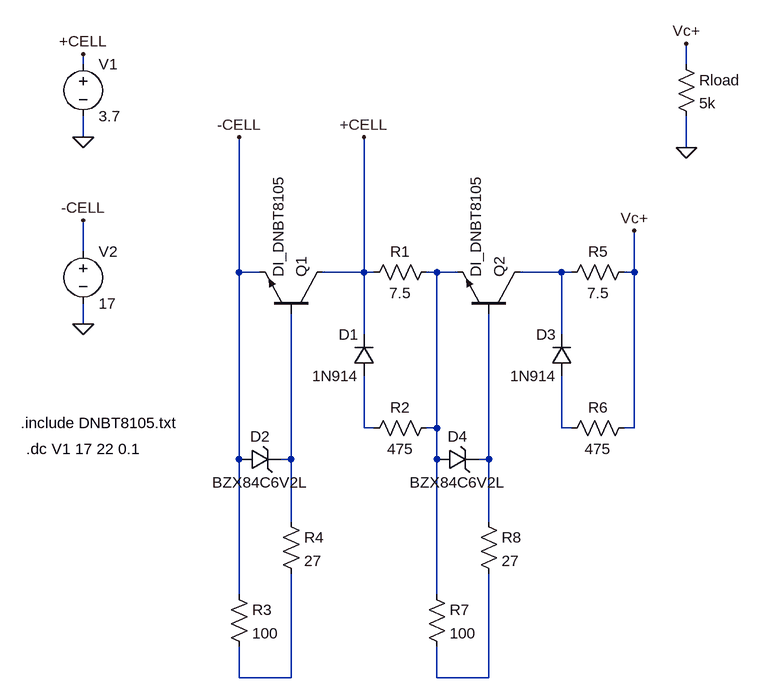
[diagram p0: schematic BalanceLeakage.asc]
BalanceLeakage.asc, the LTspice schematic file:
Version 4
SHEET 1 1096 680
WIRE 32 -272 32 -288
WIRE 960 -272 960 -304
WIRE 32 -160 32 -192
WIRE 960 -144 960 -192
WIRE 32 16 32 -32
WIRE 272 48 272 -160
WIRE 304 48 272 48
WIRE 464 48 464 -160
WIRE 464 48 400 48
WIRE 480 48 464 48
WIRE 576 48 560 48
WIRE 608 48 576 48
WIRE 768 48 704 48
WIRE 784 48 768 48
WIRE 880 48 880 -16
WIRE 880 48 864 48
WIRE 32 128 32 96
WIRE 464 144 464 48
WIRE 768 144 768 48
WIRE 464 288 464 208
WIRE 480 288 464 288
WIRE 576 288 576 48
WIRE 576 288 560 288
WIRE 768 288 768 208
WIRE 784 288 768 288
WIRE 880 288 880 48
WIRE 880 288 864 288
WIRE 272 336 272 48
WIRE 352 336 352 112
WIRE 352 336 336 336
WIRE 576 336 576 288
WIRE 656 336 656 112
WIRE 656 336 640 336
WIRE 352 432 352 336
WIRE 656 432 656 336
WIRE 272 544 272 336
WIRE 576 544 576 336
WIRE 272 672 272 624
WIRE 352 672 352 512
WIRE 352 672 272 672
WIRE 576 672 576 624
WIRE 656 672 656 512
WIRE 656 672 576 672
FLAG 32 -160 0
FLAG 32 128 0
FLAG 32 -288 +CELL
FLAG 32 -32 -CELL
FLAG 272 -160 -CELL
FLAG 464 -160 +CELL
FLAG 880 -16 Vc+
FLAG 960 -304 Vc+
FLAG 960 -144 0
SYMBOL npn 400 112 M270
SYMATTR InstName Q1
SYMATTR Value DI_DNBT8105
SYMBOL res 576 32 R90
WINDOW 0 0 56 VBottom 2
WINDOW 3 32 56 VTop 2
SYMATTR InstName R1
SYMATTR Value 7.5
SYMBOL res 576 272 R90
WINDOW 0 0 56 VBottom 2
WINDOW 3 32 56 VTop 2
SYMATTR InstName R2
SYMATTR Value 475
SYMBOL diode 480 208 R180
WINDOW 0 24 64 Left 2
WINDOW 3 24 0 Left 2
SYMATTR InstName D1
SYMATTR Value 1N914
SYMATTR Description Light Emitting Diode
SYMATTR Type led
SYMBOL zener 272 352 R270
WINDOW 0 36 32 VTop 2
WINDOW 3 -4 32 VBottom 2
SYMATTR InstName D2
SYMATTR Value BZX84C6V2L
SYMBOL res 256 528 R0
SYMATTR InstName R3
SYMATTR Value 100
SYMBOL res 336 416 R0
SYMATTR InstName R4
SYMATTR Value 27
SYMBOL npn 704 112 M270
SYMATTR InstName Q2
SYMATTR Value DI_DNBT8105
SYMBOL res 880 32 R90
WINDOW 0 0 56 VBottom 2
WINDOW 3 32 56 VTop 2
SYMATTR InstName R5
SYMATTR Value 7.5
SYMBOL res 880 272 R90
WINDOW 0 0 56 VBottom 2
WINDOW 3 32 56 VTop 2
SYMATTR InstName R6
SYMATTR Value 475
SYMBOL diode 784 208 R180
WINDOW 0 24 64 Left 2
WINDOW 3 24 0 Left 2
SYMATTR InstName D3
SYMATTR Value 1N914
SYMATTR Description Light Emitting Diode
SYMATTR Type led
SYMBOL zener 576 352 R270
WINDOW 0 36 32 VTop 2
WINDOW 3 -4 32 VBottom 2
SYMATTR InstName D4
SYMATTR Value BZX84C6V2L
SYMBOL res 560 528 R0
SYMATTR InstName R7
SYMATTR Value 100
SYMBOL res 640 416 R0
SYMATTR InstName R8
SYMATTR Value 27
SYMBOL voltage 32 -288 R0
WINDOW 123 0 0 Left 0
WINDOW 39 0 0 Left 0
SYMATTR InstName V1
SYMATTR Value 3.7
SYMBOL voltage 32 0 R0
WINDOW 123 0 0 Left 0
WINDOW 39 0 0 Left 0
SYMATTR InstName V2
SYMATTR Value 17
SYMBOL res 944 -288 R0
SYMATTR InstName Rload
SYMATTR Value 5k
TEXT -64 280 Left 2 !.include DNBT8105.txt
TEXT -56 320 Left 2 !.dc V1 17 22 0.1

The netlist it stands for:
* BalanceLeakage.asc
Q1 +CELL N005 -CELL 0 DI_DNBT8105
R1 N001 +CELL 7.5
R2 N001 N003 475
D1 N003 +CELL 1N914
D2 -CELL N005 BZX84C6V2L
R3 -CELL N007 100
R4 N005 N007 27
Q2 N002 N006 N001 0 DI_DNBT8105
R5 Vc+ N002 7.5
R6 Vc+ N004 475
D3 N004 N002 1N914
D4 N001 N006 BZX84C6V2L
R7 N001 N008 100
R8 N006 N008 27
V1 +CELL 0 3.7
V2 -CELL 0 17
Rload Vc+ 0 5k
.model D D
.lib standard.dio
.model NPN NPN
.model PNP PNP
.lib standard.bjt
.include DNBT8105.txt
.dc V1 17 22 0.1
.backanno
.end

* Results of the author's LTspice run, read from the files saved beside the schematic
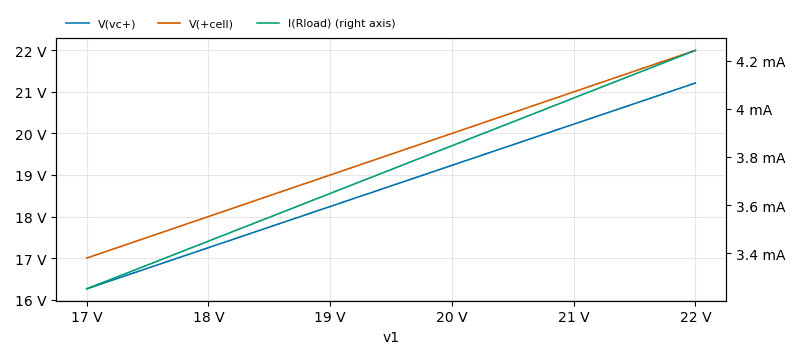
[diagram p1: DC transfer characteristic of BalanceLeakage.asc, plotted from the saved traces]
* DC transfer characteristic, 1 run:
*   V(vc+): 16.26 V at v1=17 V, 21.21 V at v1=22 V, min 16.26 V, max 21.21 V
*   V(+cell): 17 V at v1=17 V, 22 V at v1=22 V, min 17 V, max 22 V
*   I(Rload): 3.252 mA at v1=17 V, 4.243 mA at v1=22 V, min 3.252 mA, max 4.243 mA